# Altium schematic sheet Sheet1.SchDoc
size A4
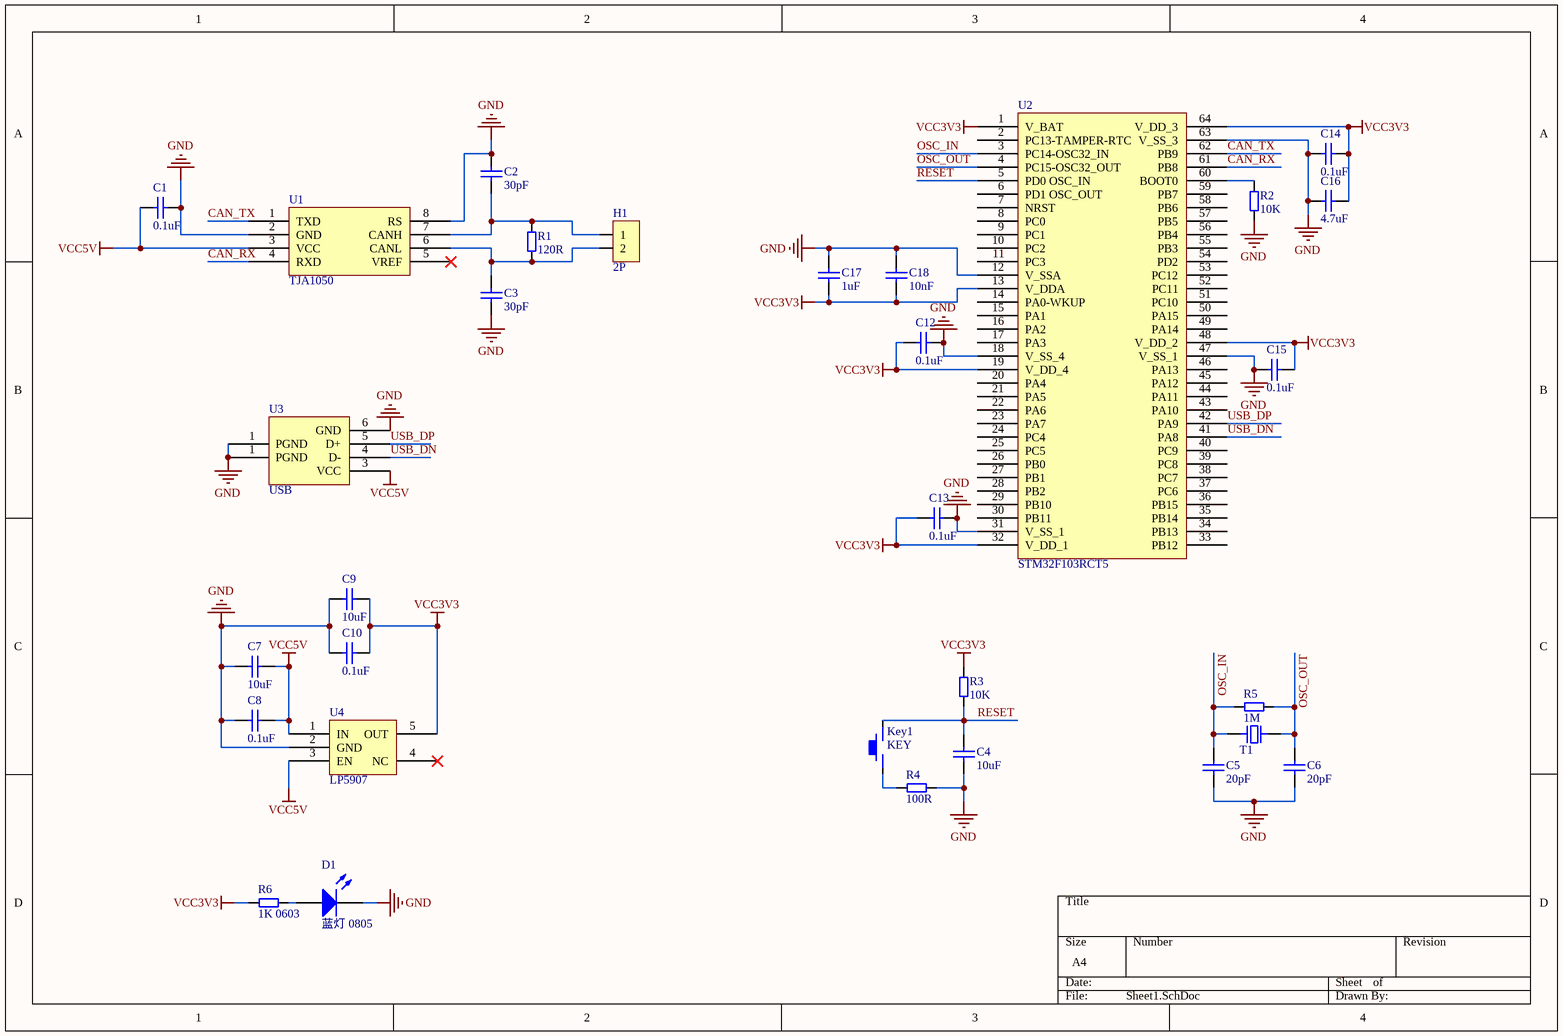
[diagram p0: Sheet1.SchDoc]

## Parts
C1  0.1uF  [C1206]
C2  30pF  [C1206]
C3  30pF  [C1206]
C4  10uF  [C1206]
C5  20pF  [C1206]
C6  20pF  [C1206]
C7  10uF  [C1206]
C8  0.1uF  [C1206]
C9  10uF  [C1206]
C10  0.1uF  [C1206]
C12  0.1uF  [C1206]
C13  0.1uF  [C1206]
C14  0.1uF  [C1206]
C15  0.1uF  [C1206]
C16  4.7uF  [C1206]
C17  1uF  [C1206]
C18  10nF  [C1206]
D1  蓝灯 0805  [0805_LED]
H1  2P  [PIN2]
Key1  KEY  [J_TS1187]
R1  120R  [R1206]
R2  10K  [R1206]
R3  10K  [R1206]
R4  100R  [R1206]
R5  1M  [R1206]
R6  1K 0603  [R1206]
T1  C5032  [CRYSTAL-SMD-5032]  (value not drawn)
U1  TJA1050  [TJA1050]
U2  STM32F103RCT5  [TSQFP50P1200X1200X160-64N]
U3  USB  [0480371000]
U4  LP5907  [SOT-23-5]

## Nets
GND: C1.2 C2.2 C3.2 C4.1 C5.1 C6.1 C7.1 C8.1 C9.1 C10.1 C12.2 C13.2 C14.1 C15.1 C16.1 C17.2 C18.2 D1.2 R2.2 R4.2 U1.2(GND) U1.8(RS) U2.12(V_SSA) U2.18(V_SS_4) U2.31(V_SS_1) U2.47(V_SS_1) U2.63(V_SS_3) U3.1(PGND) U3.6(GND) U4.2(GND)
VCC3V3: C9.2 C10.2 C12.1 C13.1 C14.2 C15.2 C16.2 C17.1 C18.1 R3.2 R6.1 U2.1(V_BAT) U2.13(V_DDA) U2.19(V_DD_4) U2.32(V_DD_1) U2.48(V_DD_2) U2.64(V_DD_3) U4.5(OUT)
VCC5V: C1.1 C7.2 C8.2 U1.3(VCC) U3.3(VCC) U4.1(IN) U4.3(EN)
CAN_RX: U1.4(RXD) U2.61(PB8)
CAN_TX: U1.1(TXD) U2.62(PB9)
OSC_IN: C5.2 R5.1 T1.1 U2.3(PC14-OSC32_IN)
OSC_OUT: C6.2 R5.2 T1.2 U2.4(PC15-OSC32_OUT)
RESET: C4.2 Key1.2 R3.1 U2.5(PD0_OSC_IN)
USB_DN: U2.41(PA8) U3.4(D-)
USB_DP: U2.42(PA9) U3.5(D+)
NetC2_1: C2.1 H1.1 R1.2 U1.7(CANH)
NetC3_1: C3.1 H1.2 R1.1 U1.6(CANL)
NetD1_1: D1.1 R6.2
NetKey1_1: Key1.1 R4.1
NetR2_1: R2.1 U2.60(BOOT0)

Not connected (* = marked no-connect by the designer): U1 5(VREF)*; U2 2(PC13-TAMPER-RTC) 6(PD1_OSC_OUT) 7(NRST) 8(PC0) 9(PC1) 10(PC2) 11(PC3) 14(PA0-WKUP) 15(PA1) 16(PA2) 17(PA3) 20(PA4) 21(PA5) 22(PA6) 23(PA7) 24(PC4) 25(PC5) 26(PB0) 27(PB1) 28(PB2) 29(PB10) 30(PB11) 33(PB12) 34(PB13) 35(PB14) 36(PB15) 37(PC6) 38(PC7) 39(PC8) 40(PC9) 43(PA10) 44(PA11) 45(PA12) 46(PA13) 49(PA14) 50(PA15) 51(PC10) 52(PC11) 53(PC12) 54(PD2) 55(PB3) 56(PB4) 57(PB5) 58(PB6) 59(PB7); U4 4(NC)*

## Library data of the parts
C1-C10 C12-C18 = C: 贴片电容; ComponentLink1Description: 供应商链接; ComponentLink1URL: http://www.szlcsc.com/product/details_2220.html; Package: 1206; Supplier: LC; SuppliersPartNumber: C1868
D1 = LED: 发光二极管; ComponentLink1Description: 供应商链接; ComponentLink1URL: http://www.szlcsc.com/product/details_2666.html; Package: 0805; Supplier: LC; SuppliersPartNumber: C2293
Key1 = KEY: 按键
R1-R6 = R: 贴片电阻